# EAGLE design INA226_breakout_v00 (EAGLE 7.7.0)
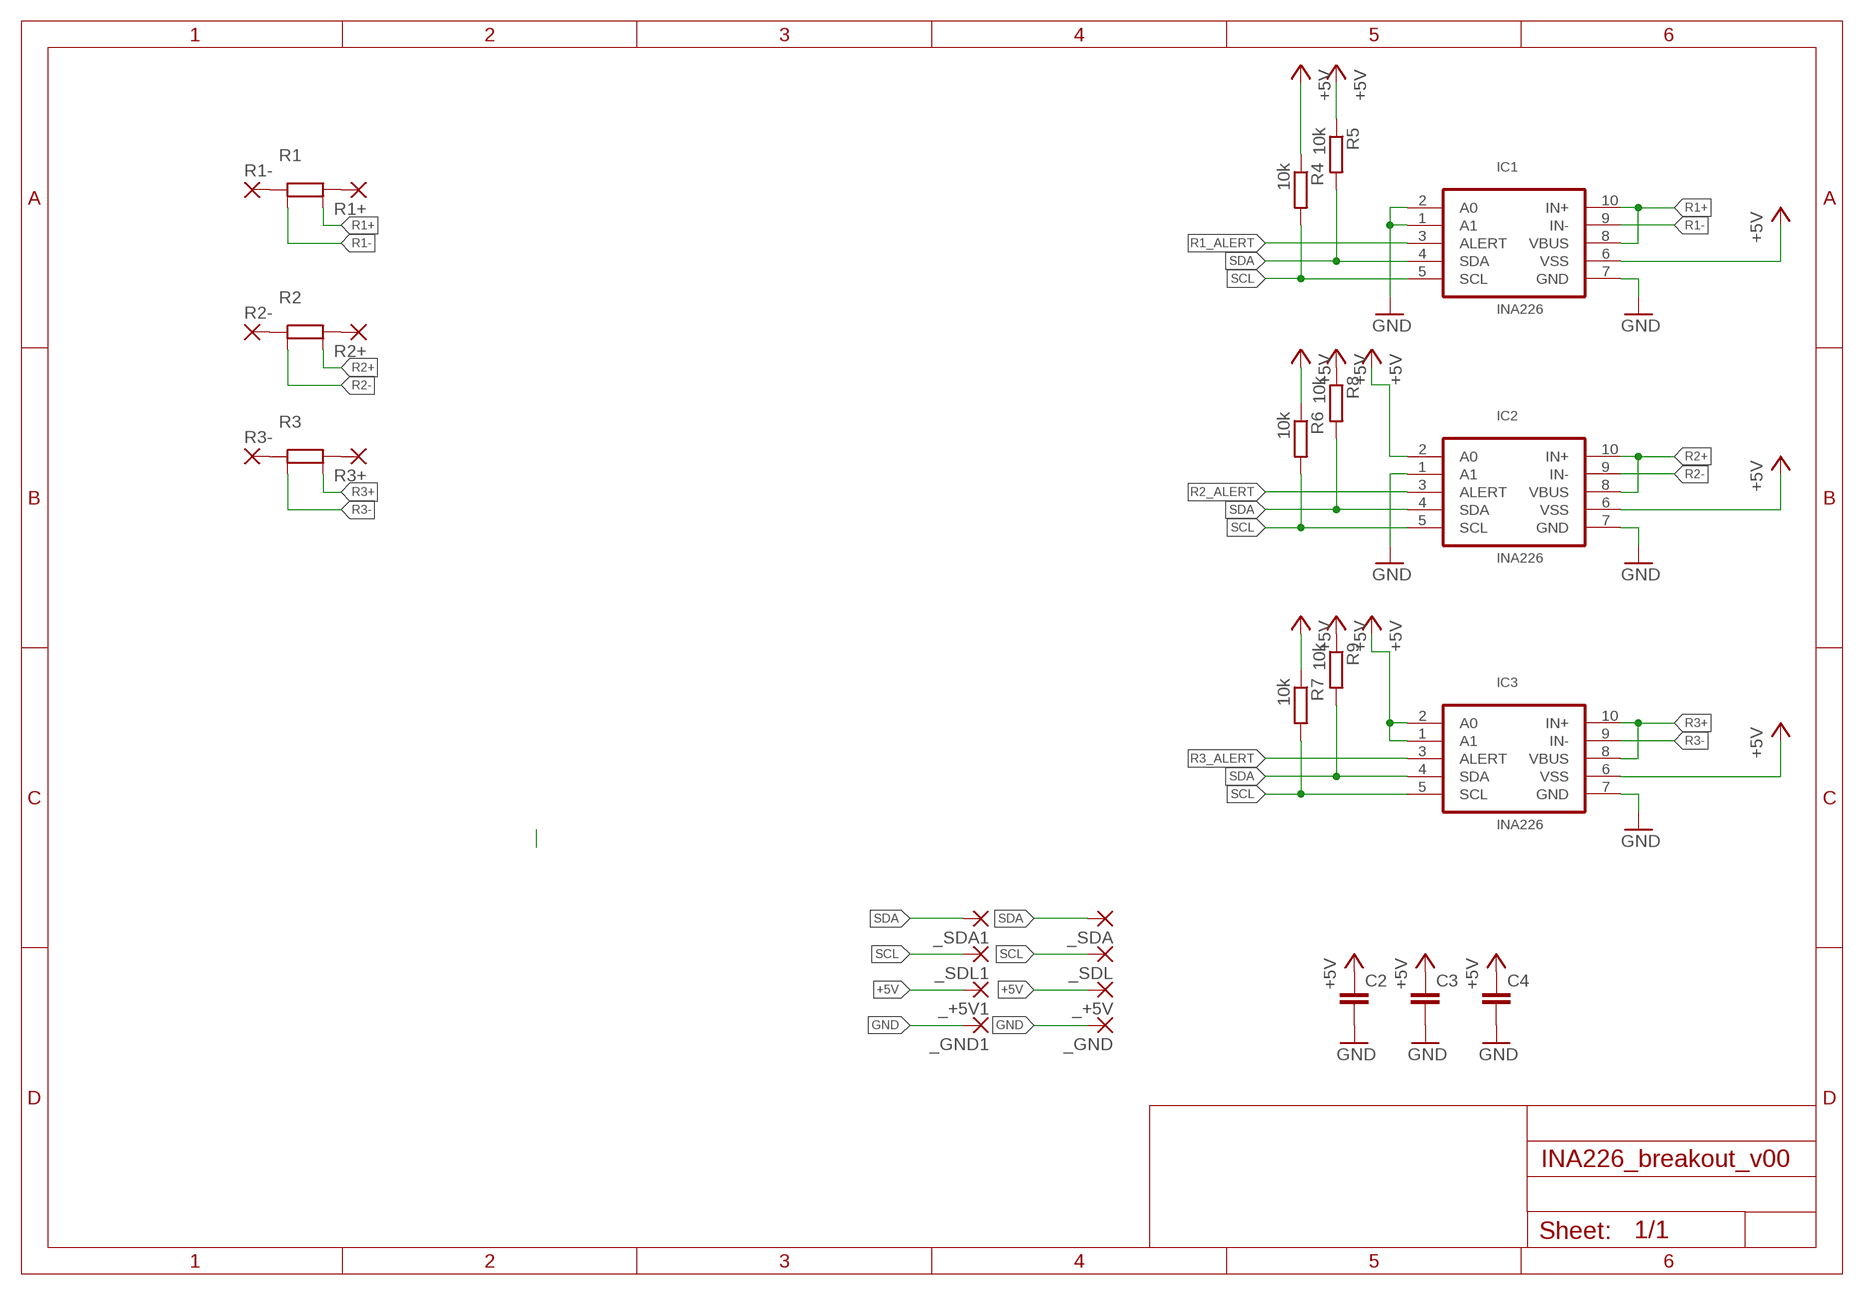
[diagram p0: schematic, sheet 1]

## Parts
_+5V  1,6/0,9  [1,6/0,9]
_+5V1  1,6/0,9  [1,6/0,9]
_GND  1,6/0,9  [1,6/0,9]
_GND1  1,6/0,9  [1,6/0,9]
_SDA  1,6/0,9  [1,6/0,9]
_SDA1  1,6/0,9  [1,6/0,9]
_SDL  1,6/0,9  [1,6/0,9]
_SDL1  1,6/0,9  [1,6/0,9]
C2  C-EUC0805  [C0805]
C3  C-EUC0805  [C0805]
C4  C-EUC0603  [C0603]
IC1  INA226  [VSSOP-10]
IC2  INA226  [VSSOP-10]
IC3  INA226  [VSSOP-10]
R1  BOURNS_CSS4J-4026  [BOURNS_CSS4J-4026]
R1+  3,81/1,4  [3,81/1,4]
R1-  3,81/1,4  [3,81/1,4]
R2  BOURNS_CSS4J-4026  [BOURNS_CSS4J-4026]
R2+  3,81/1,4  [3,81/1,4]
R2-  3,81/1,4  [3,81/1,4]
R3  BOURNS_CSS4J-4026  [BOURNS_CSS4J-4026]
R3+  3,81/1,4  [3,81/1,4]
R3-  3,81/1,4  [3,81/1,4]
R4  10k  R-EU_M0805  [M0805]
R5  10k  R-EU_M0805  [M0805]
R6  10k  R-EU_M0805  [M0805]
R7  10k  R-EU_M0805  [M0805]
R8  10k  R-EU_M0805  [M0805]
R9  10k  R-EU_M0805  [M0805]

## Nets
+5V: _+5V1.1(P) _+5V.1(P) C2.1 C3.1 C4.1 IC1.6(VSS) IC2.2(A0) IC2.6(VSS) IC3.1(A1) IC3.2(A0) IC3.6(VSS) R4.1 R5.1 R6.1 R7.1 R8.1 R9.1
GND: _GND1.1(P) _GND.1(P) C2.2 C3.2 C4.2 IC1.1(A1) IC1.2(A0) IC1.7(GND) IC2.1(A1) IC2.7(GND) IC3.7(GND)
N$2: R1-.1(P) R1.P$1
N$3: R2-.1(P) R2.P$1
N$4: R3-.1(P) R3.P$1
N$5: R1+.1(P) R1.P$2
N$6: R2+.1(P) R2.P$2
N$7: R3+.1(P) R3.P$2
R1+: IC1.8(VBUS) IC1.10(IN+) R1.PS$2(S2)
R1-: IC1.9(IN-) R1.PS$1(S1)
R1_ALERT: IC1.3(ALERT)
R2+: IC2.8(VBUS) IC2.10(IN+) R2.PS$2(S2)
R2-: IC2.9(IN-) R2.PS$1(S1)
R2_ALERT: IC2.3(ALERT)
R3+: IC3.8(VBUS) IC3.10(IN+) R3.PS$2(S2)
R3-: IC3.9(IN-) R3.PS$1(S1)
R3_ALERT: IC3.3(ALERT)
SCL: _SDL1.1(P) _SDL.1(P) IC1.5(SCL) IC2.5(SCL) IC3.5(SCL) R4.2 R6.2 R7.2
SDA: _SDA1.1(P) _SDA.1(P) IC1.4(SDA) IC2.4(SDA) IC3.4(SDA) R5.2 R8.2 R9.2

## Library data of the parts
_+5V _+5V1 _GND _GND1 _SDA _SDA1 _SDL _SDL1 = wirepad:1,6/0,9: THROUGH-HOLE PAD
C2-C4 = rcl:C-EU: CAPACITOR, European symbol
IC1-IC3 = redan_lbr:INA226: TI - INA226
R1-R3 = Keipp_3:BOURNS_CSS4J-4026
R1+ R1- R2+ R2- R3+ R3- = wirepad:3,81/1,4: THROUGH-HOLE PAD
R4-R9 = rcl:R-EU_: RESISTOR, European symbol

## Board
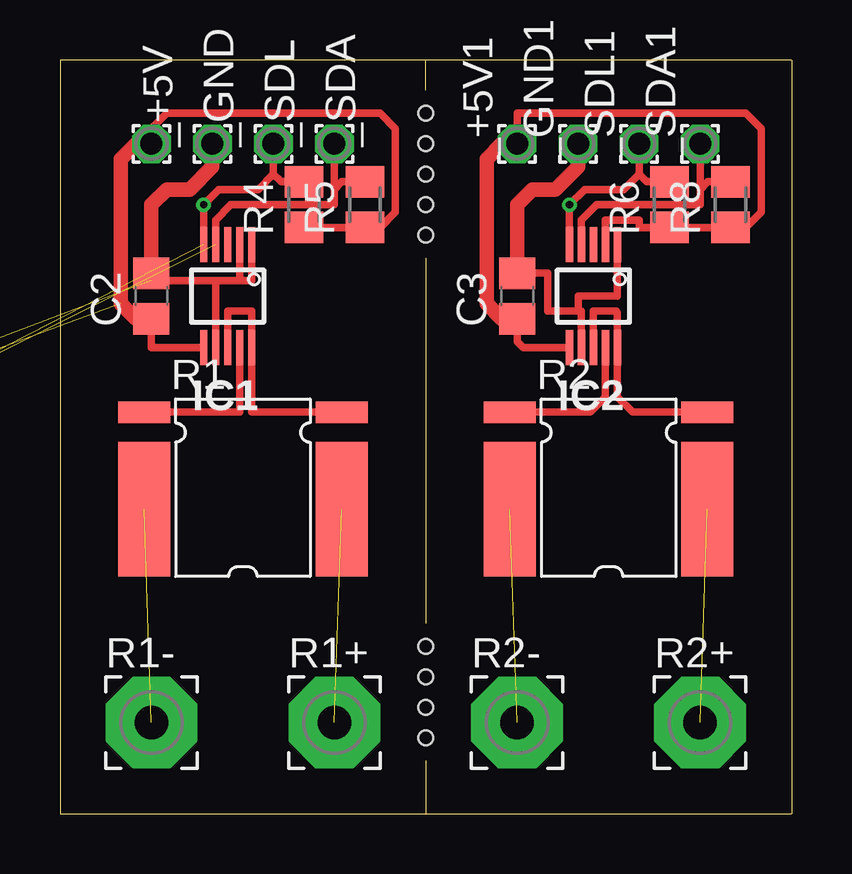
[diagram p1: board, top side]
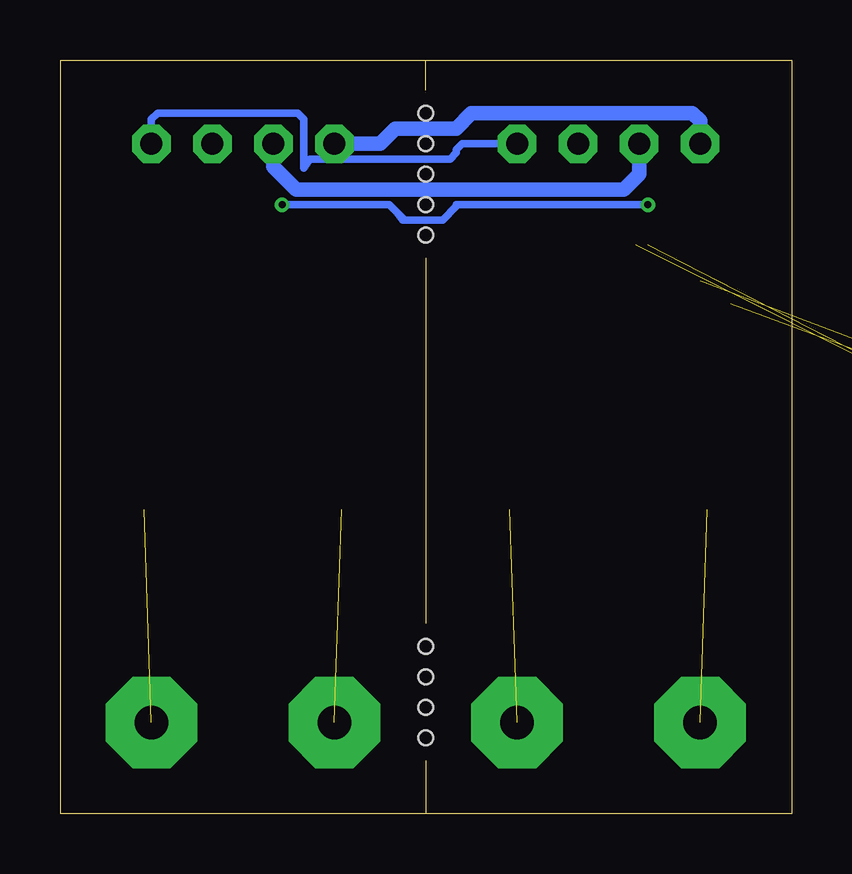
[diagram p2: board, bottom side, seen from below]

Size 30.48 x 31.43 mm. Coordinates in mm from the lower left corner, seen from the top.
Outline: 15.22,0 0,0 0,31.42 15.22,31.42
Outline: 30.46,31.42 15.24,31.42
Outline: 30.46,0 15.24,0 15.24,2.22
Outline: 30.48,31.42 30.48,0
Outline: 15.24,23.18 15.24,7.94
Outline: 15.24,30.16 15.24,31.43
Copper layers (1*16): Top 0.035mm / dielectric 1.6mm / Bottom 0.035mm
Design rules "Elecrow_2-layer_PCB_eagle_rule": minimum track width 6mil, minimum drill 12mil, track to track 6mil, track to pad 6mil, pad to pad 6mil, via to via 8mil, smd to smd 0mil, copper to edge 20mil, drill to drill 10mil, minimum pad ring 6mil, minimum via ring 6mil, stop-mask expansion 0mil, vias tented up to drill 100mil, thermal gap 10mil
Holes 0.6 mm at 15.24,26.67 15.24,25.4 15.24,27.94 15.24,24.13 15.24,29.21 15.24,6.99 15.24,5.71 15.24,4.45 15.24,3.17

### Footprints (pad centres in the part's own frame; a part is rotated, then mirrored left to right if it is on the bottom)
1,6/0,9 = drill 0.914 pad 1.6 octagon: 1 0,0
C0805 = smd 1.3 x 1.5: 1 -0.95,0; 2 0.95,0
C0603 = smd 1.1 x 1: 1 -0.85,0; 2 0.85,0
VSSOP-10 = smd 0.3 x 1.45: 1 -1,-2.15; 2 -0.5,-2.15; 3 0,-2.15; 4 0.5,-2.15; 5 1,-2.15; 6 1,2.15; 7 0.5,2.15; 8 0,2.15; 9 -0.5,2.15; 10 -1,2.15
BOURNS_CSS4J-4026 = smd 2.17 x 5.6: P$1 -4.115,0; P$2 4.115,0 | smd 2.17 x 0.9: PS$1 -4.115,4.05; PS$2 4.115,4.05
3,81/1,4 = drill 1.397 pad 3.81 octagon: 1 0,0
M0805 = smd 1.3 x 1.6: 1 -0.95,0; 2 0.95,0

### Placement (x,y rotation side)
_+5V  3.81,27.94 0 top
_+5V1  19.05,27.94 90 top
_GND  6.35,27.94 0 top
_GND1  21.59,27.94 90 top
_SDA  11.43,27.94 0 top
_SDA1  26.67,27.94 90 top
_SDL  8.89,27.94 0 top
_SDL1  24.13,27.94 90 top
C2  3.81,21.59 90 top
C3  19.05,21.59 90 top
C4  -35.56,39.37 0 top  (outside the outline)
IC1  6.99,21.59 180 top
IC2  22.23,21.59 180 top
IC3  -33.02,6.35 0 top  (outside the outline)
R1  7.62,12.7 0 top
R1+  11.43,3.81 0 top
R1-  3.81,3.81 0 top
R2  22.86,12.7 0 top
R2+  26.67,3.81 0 top
R2-  19.05,3.81 0 top
R3  -19.05,25.4 0 top  (outside the outline)
R3+  -25.4,34.29 0 top  (outside the outline)
R3-  -30.48,34.29 0 top  (outside the outline)
R4  10.16,25.4 90 top
R5  12.7,25.4 90 top
R6  25.4,25.4 90 top
R7  -43.18,-10.16 0 top  (outside the outline)
R8  27.94,25.4 90 top
R9  -43.18,-22.86 0 top  (outside the outline)

### Tracks (layer width: path | path; a pad name or v marks a point on that pad's centre or on a via)
+5V  (6 unrouted)
  Top 0.305: C2.1 3.81,19.44 IC1.6 | R4.1 R5.1 13.34,24.45 13.97,25.09 13.97,28.57 13.34,29.21 4.45,29.21 3.81,28.57 _+5V.1 | IC2.6 19.3,19.44 19.05,19.68 C3.1 | IC2.2 22.73,24.77 24.13,24.77 24.13,24.45 R6.1 R8.1 28.57,24.45 29.21,25.09 29.21,28.57 28.57,29.21 19.05,29.21 _+5V1.1
  Top 0.61: _+5V.1 3.17,27.94 2.54,27.3 2.54,21.27 3.17,20.64 C2.1 | _+5V1.1 18.41,27.94 17.78,27.3 17.78,21.27 18.41,20.64 C3.1
  Bottom 0.61: _+5V.1 3.81,28.89 4.13,29.21 13.34,29.21 13.97,28.57 16.51,28.57 17.14,27.94 _+5V1.1
GND  (2 unrouted)
  Top 0.305: IC1.1 7.99,22.23 7.49,22.23 | 6.49,22.23 3.81,22.23 C2.2 | 6.49,22.23 7.49,22.23 | 7.49,22.23 IC1.2 | 6.49,22.23 IC1.7 | C3.2 20.32,22.54 20.32,20.95 21.59,20.95 | 21.59,20.95 21.73,20.95 IC2.7 | 21.59,20.95 21.59,21.59 23.23,21.59 IC2.1
  Top 0.61: _GND.1 6.35,26.99 5.4,26.04 4.45,26.04 3.81,25.4 C2.2 | _GND1.1 21.59,26.99 20.64,26.04 19.68,26.04 19.05,25.4 C3.2
  Bottom 0.61: _GND1.1 21.59,26.99 20.64,26.04 6.99,26.04 6.35,26.67 _GND.1
N$2  (1 unrouted)
N$3  (1 unrouted)
N$4  (1 unrouted)
N$5  (1 unrouted)
N$6  (1 unrouted)
N$7  (1 unrouted)
R1+
  Top 0.305: R1.PS$2 7.99,16.75 IC1.10 7.99,20.95 6.99,20.95 IC1.8
R1-
  Top 0.305: R1.PS$1 7.49,16.75 IC1.9
R2+
  Top 0.305: R2.PS$2 23.86,16.75 23.23,17.39 IC2.10 23.23,20.91 23.18,20.95 22.23,20.95 IC2.8
R2-
  Top 0.305: R2.PS$1 22.09,16.75 22.73,17.39 IC2.9
R3+  (2 unrouted)
R3-  (1 unrouted)
SCL  (via drill 0.3)  (2 unrouted)
  Top 0.305: _SDL.1 8.89,26.67 | 8.89,26.67 8.26,26.04 6.62,26.04 v5.99,25.4 IC1.5 | R4.2 9.21,26.35 8.89,26.67 | _SDL1.1 24.13,26.67 | 24.13,26.67 23.5,26.04 21.86,26.04 v21.23,25.4 IC2.5 | R6.2 24.45,26.35 24.13,26.67
  Bottom 0.305: v5.99,25.4 13.97,25.4 13.97,25.34 14.54,24.77 16.19,24.77 | 16.19,24.77 16.19,24.83 16.45,25.08 16.19,24.77 | 16.19,24.77 16.51,25.15 16.76,25.4 v21.23,25.4
SDA  (2 unrouted)
  Top 0.305: _SDA.1 11.43,26.04 | 11.43,26.04 11.43,25.4 7.12,25.4 6.49,24.77 IC1.4 | R5.2 11.74,26.35 11.43,26.04 | _SDA1.1 26.67,26.04 | 26.67,26.04 26.67,25.4 22.36,25.4 21.73,24.77 IC2.4 | R8.2 26.98,26.35 26.67,26.04
  Bottom 0.305: _SDA.1 13.72,27.94 13.97,27.69 13.97,27.56 14.22,27.3 20.07,27.3 20.32,26.92 20.32,28.96 20.57,29.21 26.42,29.21 26.67,28.96 _SDA1.1